# EAGLE schematic main board (EAGLE 7.7.0)
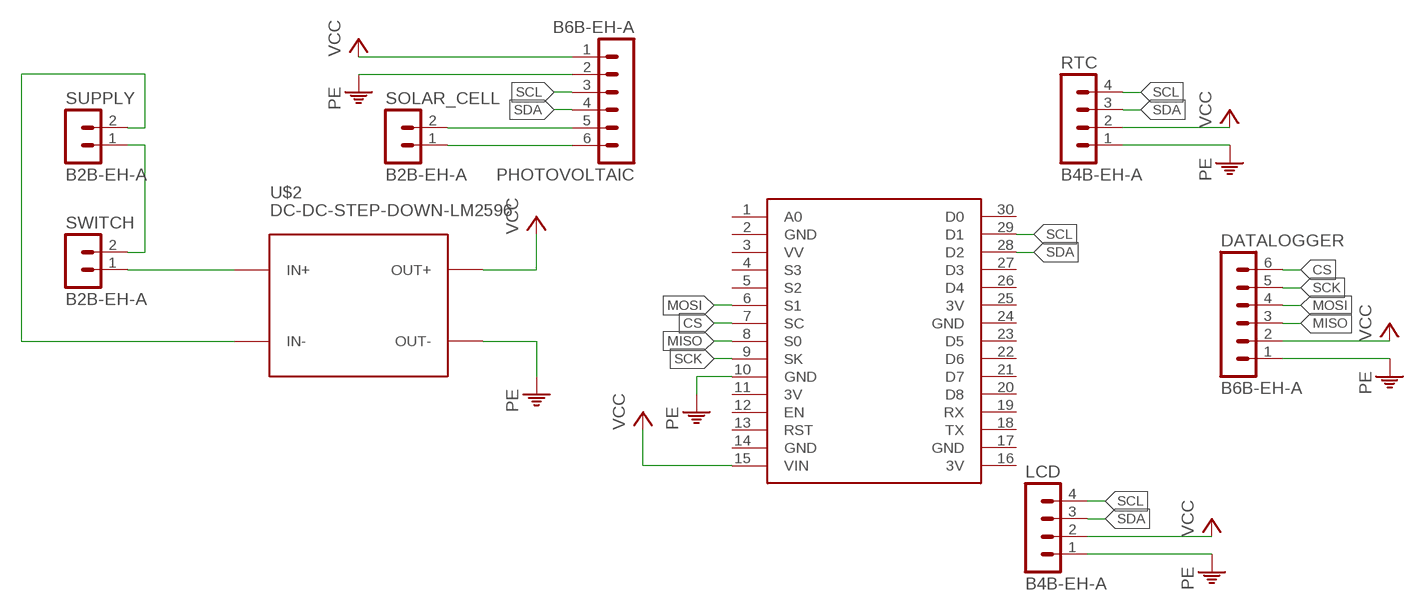
[diagram p0: schematic, sheet 1]

## Parts
DATALOGGER  B6B-EH-A  [B6B-EH-A]
LCD  B4B-EH-A  [B4B-EH-A]
PHOTOVOLTAIC  B6B-EH-A  [B6B-EH-A]
RTC  B4B-EH-A  [B4B-EH-A]
SOLAR_CELL  B2B-EH-A  [B2B-EH-A]
SUPPLY  B2B-EH-A  [B2B-EH-A]
SWITCH  B2B-EH-A  [B2B-EH-A]
U$1  NODEMCU  [NODEMCU]
U$2  DC-DC-STEP-DOWN-LM2596  [DC-DC-STEP-DOWN-LM2596]

## Nets
CS: DATALOGGER.6 U$1.7(SC)
MISO: DATALOGGER.3 U$1.8(S0)
MOSI: DATALOGGER.4 U$1.6(S1)
N$1: PHOTOVOLTAIC.6 SOLAR_CELL.1
N$2: SUPPLY.2 U$2.IN-
N$3: SUPPLY.1 SWITCH.2
N$4: SWITCH.1 U$2.IN+
N$5: PHOTOVOLTAIC.5 SOLAR_CELL.2
PE: DATALOGGER.1 LCD.1 PHOTOVOLTAIC.2 RTC.1 U$1.10(GND) U$2.OUT-
SCK: DATALOGGER.5 U$1.9(SK)
SCL: LCD.4 PHOTOVOLTAIC.3 RTC.4 U$1.29(D1)
SDA: LCD.3 PHOTOVOLTAIC.4 RTC.3 U$1.28(D2)
VCC: DATALOGGER.2 LCD.2 PHOTOVOLTAIC.1 RTC.2 U$1.15(VIN) U$2.OUT+
Unconnected: U$1.1(A0) U$1.3(VV) U$1.4(S3) U$1.5(S2) U$1.12(EN) U$1.13(RST) U$1.18(TX) U$1.19(RX) U$1.20(D8) U$1.21(D7) U$1.22(D6) U$1.23(D5) U$1.26(D4) U$1.27(D3) U$1.30(D0)

## Power pins joined to a net without a drawn wire
3V: U$1.11(3V) U$1.16(3V) U$1.25(3V)
GND: U$1.2(GND) U$1.14(GND) U$1.17(GND) U$1.24(GND)

## Library data of the parts
DATALOGGER PHOTOVOLTAIC = con-JST EH:B6B-EH: JST EH series header 2.50mm pitch disconnectable crimp style connectors, vertical (side entry type), 6 pins
LCD RTC = con-JST EH:B4B-EH: JST EH series header 2.50mm pitch disconnectable crimp style connectors, vertical (side entry type), 4 pins
SOLAR_CELL SUPPLY SWITCH = con-JST EH:B2B-EH: JST EH series header 2.50mm pitch disconnectable crimp style connectors, vertical (side entry type), 2 pins
U$1 = nodemcu(1):NODEMCU
U$2 = diy-modules:DC-DC-STEP-DOWN-LM2596: DC/DC Step-Down Regulator based on LM2596-ADJ chip LM2596 datasheet available here: http://www.ti.com/lit/ds/symlink/lm2596.pdf Click here to find device on ebay.com <http://www.ebay.com/sch/lm2596+power+regulator>